# EAGLE design amplifier (EAGLE 9.2.2)
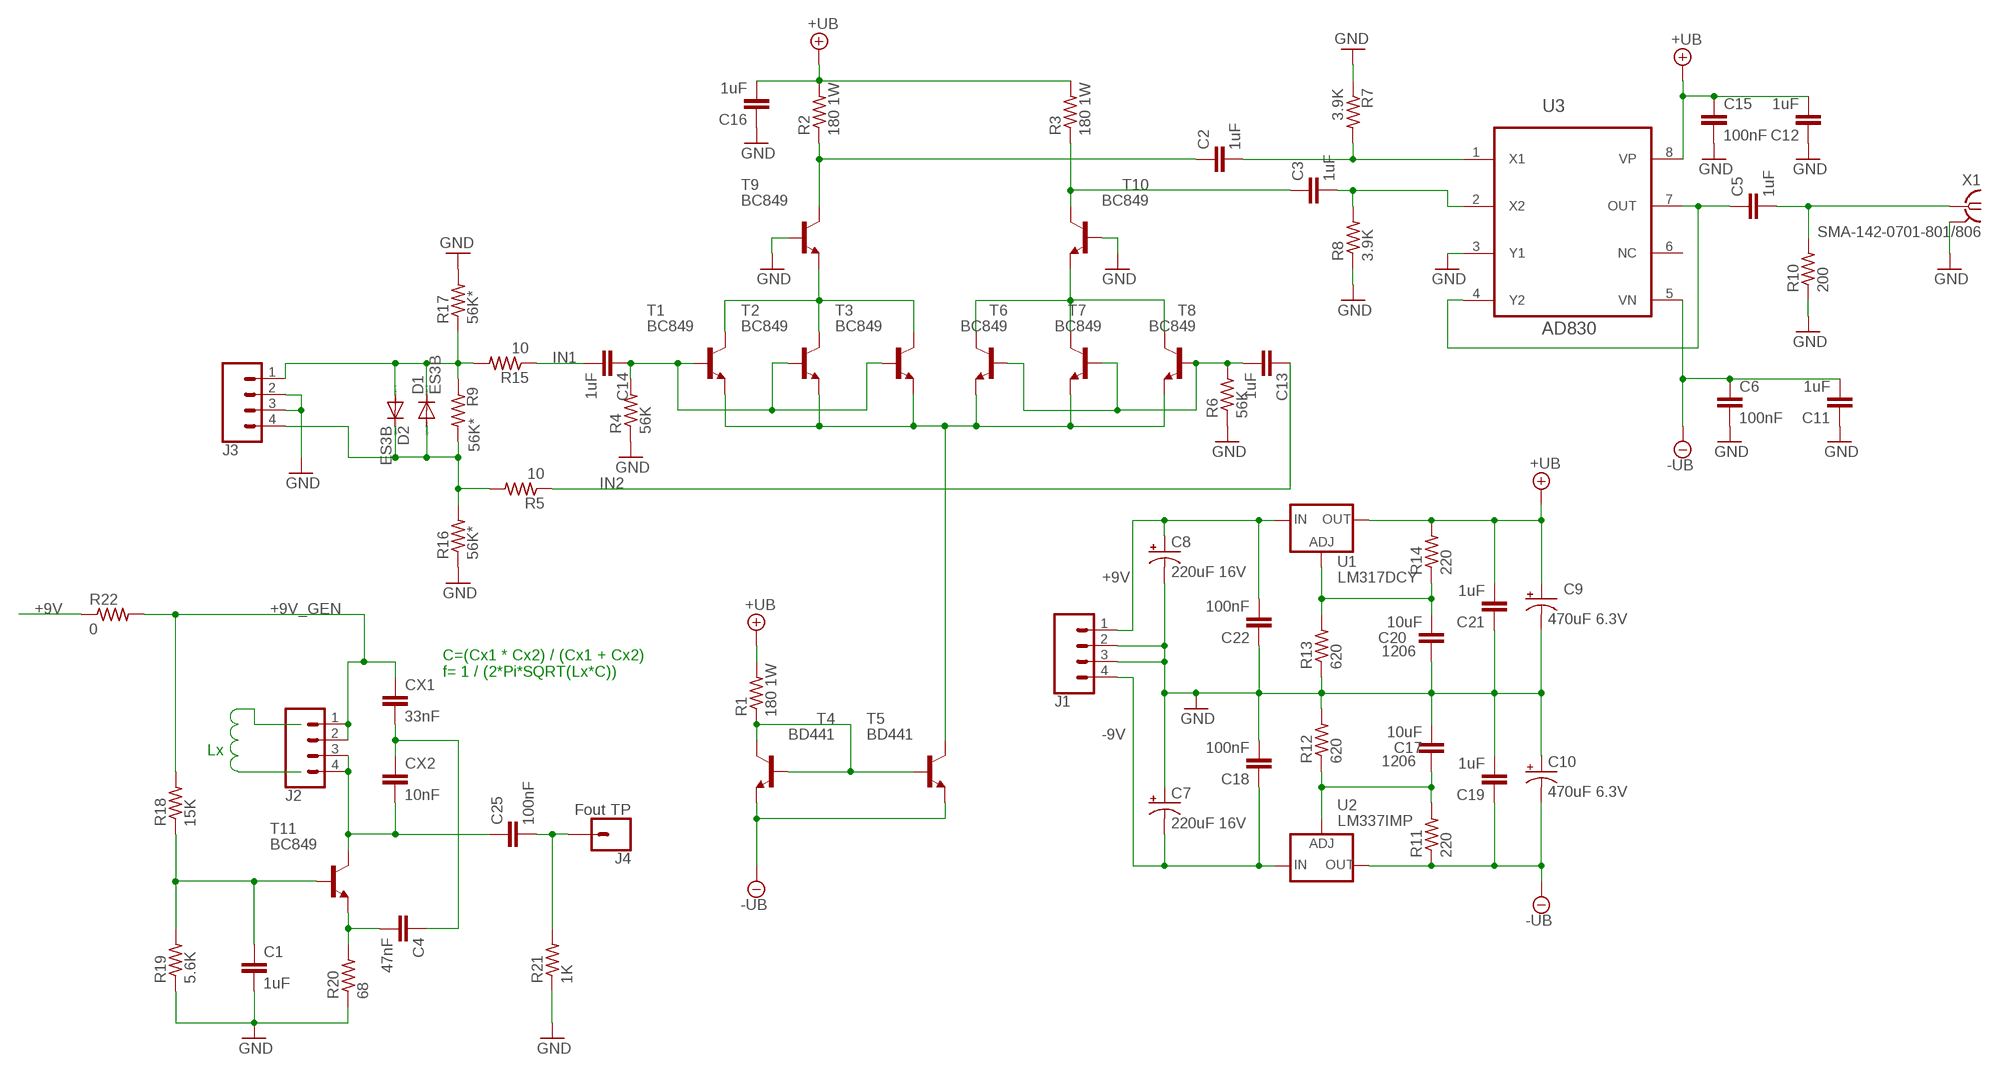
[diagram p0: schematic, sheet 1]

## Parts
C1  1uF  C-EUC0805  [C0805]
C2  1uF  C-EUC0805  [C0805]
C3  1uF  C-EUC0805  [C0805]
C4  47nF  C-EUC0805  [C0805]
C5  1uF  C-EUC0805  [C0805]
C6  100nF  C-EUC0805  [C0805]
C7  220uF 16V  CPOL-US153CLV-1010  [153CLV-1010]
C8  220uF 16V  CPOL-US153CLV-1010  [153CLV-1010]
C9  470uF 6.3V  CPOL-US153CLV-1010  [153CLV-1010]
C10  470uF 6.3V  CPOL-US153CLV-1010  [153CLV-1010]
C11  1uF  C-EUC0805  [C0805]
C12  1uF  C-EUC0805  [C0805]
C13  1uF  C-EUC0805  [C0805]
C14  1uF  C-EUC0805  [C0805]
C15  100nF  C-EUC0805  [C0805]
C16  1uF  C-EUC0805  [C0805]
C17  10uF  C-EUC1206  [C1206]
C18  100nF  C-EUC0805  [C0805]
C19  1uF  C-EUC0805  [C0805]
C20  10uF  C-EUC1206  [C1206]
C21  1uF  C-EUC0805  [C0805]
C22  100nF  C-EUC0805  [C0805]
C25  100nF  C-EUC0805  [C0805]
CX1  33nF  C-EUC0805  [C0805]
CX2  10nF  C-EUC0805  [C0805]
D1  ES3B  DIODE-SMC  [SMC]
D2  ES3B  DIODE-SMC  [SMC]
J1  CONN_04LONGPADS  [1X04_LONGPADS]
J2  CONN_04LONGPADS  [1X04_LONGPADS]
J3  CONN_04LONGPADS  [1X04_LONGPADS]
J4  Fout TP  CONN_01SNAP-MALE  [SNAP-MALE]
R1  180 1W  R-US_R1206W  [R1206W]
R2  180 1W  R-US_R1206W  [R1206W]
R3  180 1W  R-US_R1206W  [R1206W]
R4  56K  R-US_R1206W  [R1206W]
R5  10  R-US_R1206W  [R1206W]
R6  56K  R-US_R1206W  [R1206W]
R7  3.9K  R-US_R1206W  [R1206W]
R8  3.9K  R-US_R1206W  [R1206W]
R9  56K*  R-US_R1206W  [R1206W]
R10  200  R-US_R1206W  [R1206W]
R11  220  R-US_R1206W  [R1206W]
R12  620  R-US_R1206W  [R1206W]
R13  620  R-US_R1206W  [R1206W]
R14  220  R-US_R1206W  [R1206W]
R15  10  R-US_R1206W  [R1206W]
R16  56K*  R-US_R1206W  [R1206W]
R17  56K*  R-US_R1206W  [R1206W]
R18  15K  R-US_R1206W  [R1206W]
R19  5.6K  R-US_R1206W  [R1206W]
R20  68  R-US_R1206W  [R1206W]
R21  1K  R-US_R1206W  [R1206W]
R22  0  R-US_R1206W  [R1206W]
T1  BC849  [SOT23]
T2  BC849  [SOT23]
T3  BC849  [SOT23]
T4  BD441  -NPN-TO126  [TO126]
T5  BD441  -NPN-TO126  [TO126]
T6  BC849  [SOT23]
T7  BC849  [SOT23]
T8  BC849  [SOT23]
T9  BC849  [SOT23]
T10  BC849  [SOT23]
T11  BC849  [SOT23]
U1  LM317DCY  [SOT223]
U2  LM337IMP  [SOT223]
U3  AD830  [SOIC127P600X175-8N]
X1  SMA-142-0701-801/806  [J502-ND-142-0701-801/806]

## Nets
+9V [power]: C8.+ C22.2 J1.1 R22.1 U1.3(IN)
+9V_GEN [power]: CX1.1 J2.1 J2.2 R18.2 R22.2
+UB [power]: C9.+ C12.2 C15.1 C16.2 C21.2 R1.2 R2.2 R3.2 R14.2 U1.2(OUT) U1.4(OUT) U3.8(VP)
-9V [power]: C7.- C18.1 J1.4 U2.2(IN) U2.4(IN)
-UB [power]: C6.1 C10.- C11.2 C19.1 R11.1 T4.1(E) T5.1(E) U2.3(OUT) U3.5(VN)
GND [power]: C1.2 C6.2 C7.+ C8.- C9.- C10.+ C11.1 C12.1 C15.2 C16.1 C17.2 C18.2 C19.2 C20.1 C21.1 C22.1 J1.2 J1.3 J3.2 J3.3 R4.1 R6.1 R7.1 R8.1 R10.1 R12.2 R13.1 R16.1 R17.2 R19.1 R20.1 R21.1 T9.1(B) T10.1(B) U3.3(Y1) X1.G@1 X1.G@2 X1.G@3 X1.G@4
IN1: C14.2 R15.1
IN2: C13.1 R5.1
N$1: D1.C D2.A J3.1 R9.1 R15.2 R17.1
N$2: C17.1 R11.2 R12.1 U2.1(ADJ)
N$3: D1.A D2.C J3.4 R5.2 R9.2 R16.2
N$5: R1.1 T4.2(C) T4.3(B) T5.3(B)
N$6: C25.1 CX2.2 J2.3 J2.4 T11.3(C)
N$7: C2.2 R7.2 U3.1(X1)
N$8: C25.2 J4.2 R21.2
N$9: C20.2 R13.2 R14.1 U1.1(ADJ)
N$10: C4.1 CX1.2 CX2.1
N$11: C4.2 R20.2 T11.2(E)
N$12: T1.2(E) T2.2(E) T3.2(E) T5.2(C) T6.2(E) T7.2(E) T8.2(E)
N$13: C1.1 R18.1 R19.2 T11.1(B)
N$14: C13.2 R6.2 T6.1(B) T7.1(B) T8.1(B)
N$15: C14.1 R4.2 T1.1(B) T2.1(B) T3.1(B)
N$16: T1.3(C) T2.3(C) T3.3(C) T9.2(E)
N$19: T6.3(C) T7.3(C) T8.3(C) T10.2(E)
N$23: C2.1 R2.1 T9.3(C)
N$24: C3.1 R3.1 T10.3(C)
N$25: C3.2 R8.2 U3.2(X2)
N$26: C5.1 U3.4(Y2) U3.7(OUT)
N$27: C5.2 R10.2 X1.1

## Notes on the sheet
- C=(Cx1 * Cx2) / (Cx1 + Cx2)
  f= 1 / (2*Pi*SQRT(Lx*C))
- Lx

## Power pins joined to a net without a drawn wire
NC: U3.6(NC)

## Library data of the parts
C1-C6 C11-C16 C18 C19 C21 C22 C25 CX1 CX2 = resistor:C-EU: CAPACITOR, European symbol
C7-C10 = rcl:CPOL-US: POLARIZED CAPACITOR, American symbol; SPICEPREFIX: C
C17 C20 = resistor:C-EU: CAPACITOR, European symbol; PACKAGE: 1206
D1 D2 = diode:DIODE-: DIODE
J1-J3 = SparkFun-Connectors:CONN_04: Multi connection point. Often used as Generic Header-pin footprint for 0.1 inch spaced/style header connections On any of the 0.1 inch spaced packages, you can populate with these: Break Away Headers - Straight <https://www.sparkfun.com/products/116> (PRT-00116) Break Away Male Headers - Right Angle <https://www.sparkfun.com/products/553> (PRT-00553) Female Headers <https://www.sparkfun.com/products/115> (PRT-00115) Break Away Headers - Machine Pin <https://www.sparkfun.com/products/117> (PRT-00117) Break Away Female Headers - Swiss Machine Pin <https://www.sparkfun.com/products/743> (PRT-00743) For SCREWTERMINALS and SPRING TERMINALS visit here: Screw Terimnals on SparkFun.com <https://www.sparkfun.com/search/results?term=Screw+Terminals> (5mm/3.5mm/2.54mm spacing) This device is also useful as a general connection point to wire up your design to another part of your project. Our various solder wires solder well into these plated through hole pads. Hook-Up Wire - Assortment (Stranded, 22 AWG) <https://www.sparkfun.com/products/11375> (PRT-11375) Hook-Up Wire - Assortment (Solid Core, 22 AWG) <https://www.sparkfun.com/products/11367> (PRT-11367) View the entire wire category on our website here <https://www.sparkfun.com/categories/141> Special notes: Molex polarized connector foot print use with SKU : PRT-08231 with associated crimp pins and housings. 1MM SMD Version SKU: PRT-10208; PROD_ID: CONN-09696
J4 = SparkFun-Connectors:CONN_01: Single connection point. Often used as Generic Header-pin footprint for 0.1 inch spaced/style header connections On any of the 0.1 inch spaced packages, you can populate with these: Break Away Headers - Straight <https://www.sparkfun.com/products/116> (PRT-00116) Break Away Male Headers - Right Angle <https://www.sparkfun.com/products/553> (PRT-00553) Female Headers <https://www.sparkfun.com/products/115> (PRT-00115) Break Away Headers - Machine Pin <https://www.sparkfun.com/products/117> (PRT-00117) Break Away Female Headers - Swiss Machine Pin <https://www.sparkfun.com/products/743> (PRT-00743) This device is also useful as a general connection point to wire up your design to another part of your project. Our various solder wires solder well into these plated through hole pads. Hook-Up Wire - Assortment (Stranded, 22 AWG) <https://www.sparkfun.com/products/11375> (PRT-11375) Hook-Up Wire - Assortment (Solid Core, 22 AWG) <https://www.sparkfun.com/products/11367> (PRT-11367) View the entire wire category on our website here <https://www.sparkfun.com/categories/141> Special notes: SMTSO-256-ET is a "flush mount" nut for a 4-40 screw. We mostly use this on specialty testbeds; it is a nice way to connect hardware to your PCB at an adjustable hieght. Also note, the SNAP packages are for using a snappable style connector. We sell a baggie of snaps and they are also used on two LilyPad designs: Snap Assortment - 30 pack (male and female) <https://www.sparkfun.com/products/11347> (DEV-11347) LilyPad Arduino SimpleSnap <https://www.sparkfun.com/products/10941> (DEV-10941) LilyPad SimpleSnap Protoboard <https://www.sparkfun.com/products/10940> (DEV-10940)
R1-R22 = resistor:R-US_: RESISTOR, American symbol
T1-T3 T6-T11 = transistor:BC849: NPN TRANSISTOR
T4 T5 = transistor:*-NPN-: NPN Transistror BF959 corrected 2008.03.06
U1 = modified-v-reg:LM317DCY
U2 = modified-v-reg:LM337IMP: Adjustable 3-terminal negative-voltage regulator capable of supplying in excess of –1.5 A over an output voltage range of –1.2 to –37 V.
U3 = AD830:AD830
X1 = con-coax:SMA-: SMA 50 Ohm End Launch Jack Receptacle - Round Contact Johnson Components Source: www.johnsoncomponents.com .. J502-ND.pdf; MF: JOHNSON COMPONENTS; MPN: 142-0701-801; OC_FARNELL: 1608592; OC_NEWARK: 90F2624

## Net classes
0 default: width 0.3 mm, drill 0.3 mm, clearance 0.508 mm
1 power: width 0.61 mm, drill 0.5 mm, clearance 0.508 mm to class 0, clearance 0.508 mm

## Board
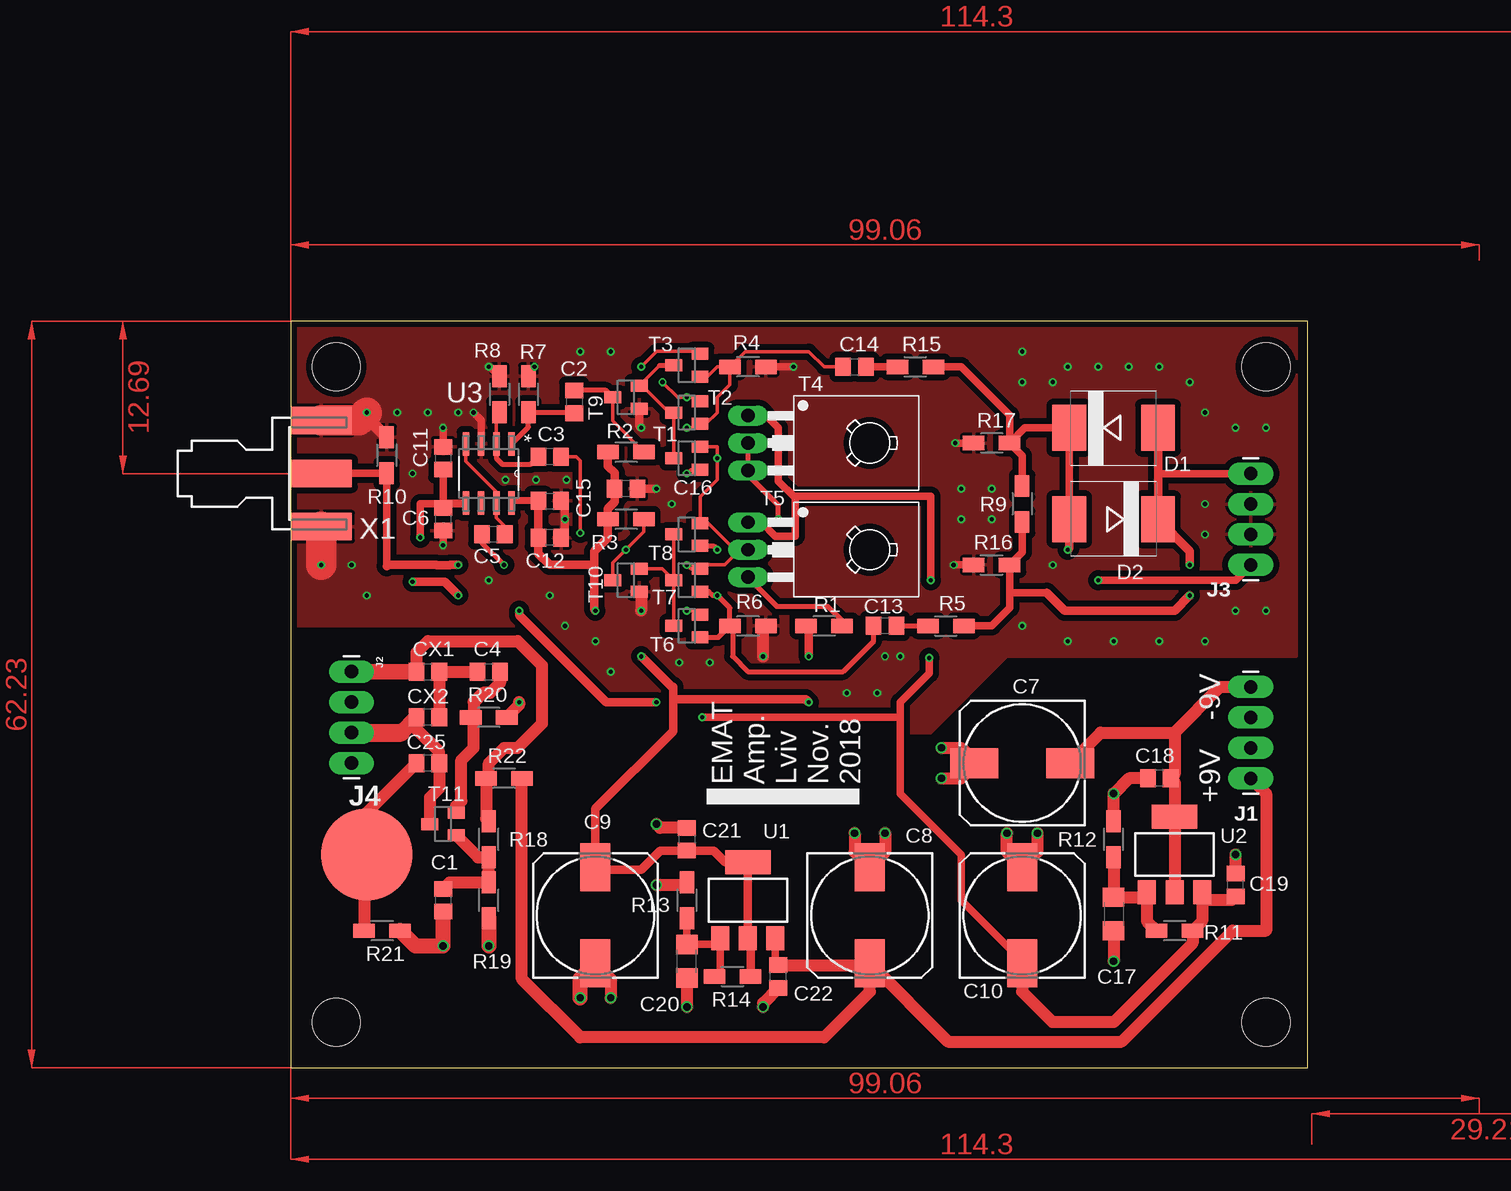
[diagram p1: board, top side]
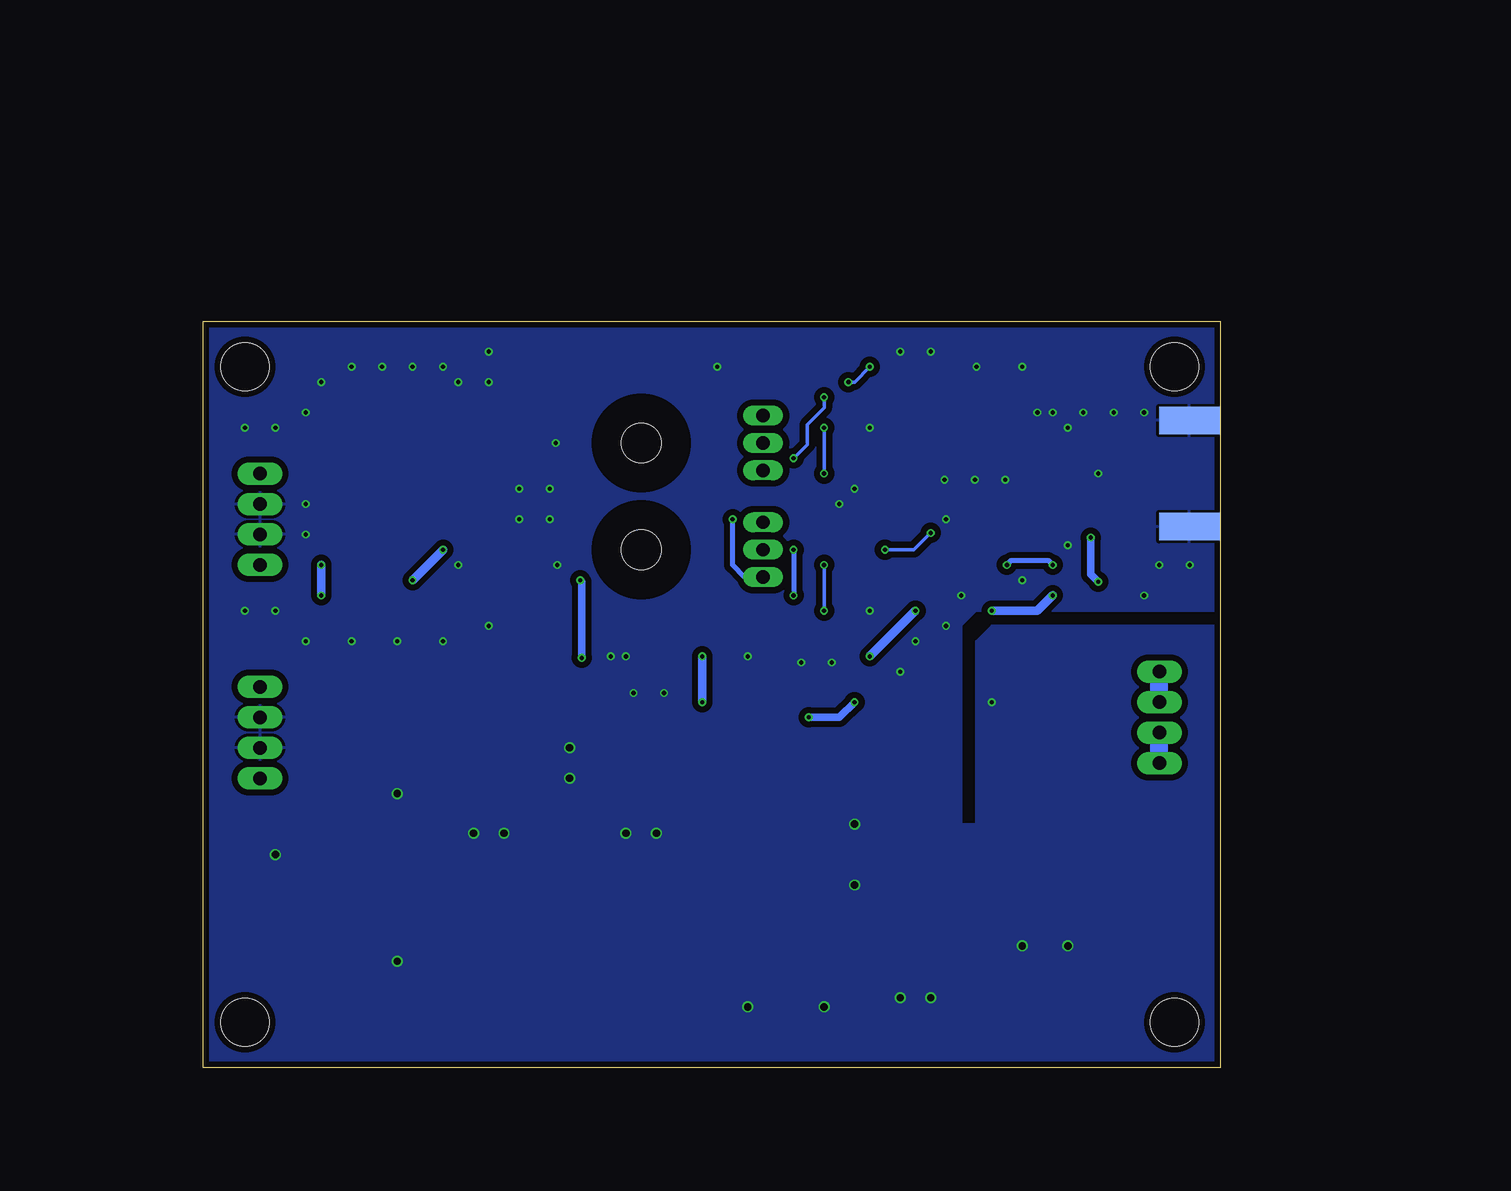
[diagram p2: board, bottom side, seen from below]

Size 84.76 x 62.22 mm. Coordinates in mm from the lower left corner, seen from the top.
Outline: 0,0 84.76,0 84.76,62.22 0,62.22 0,0
Copper layers (1*16): Top 0.035mm / dielectric 1.6mm / Bottom 0.035mm
Design rules "Elecrow_2-layer_PCB_eagle_rule *": minimum track width 6mil, minimum drill 0.3mm, track to track 6mil, track to pad 6mil, pad to pad 6mil, via to via 8mil, smd to smd 0mil, copper to edge 20mil, drill to drill 10mil, minimum pad ring 6mil, minimum via ring 6mil, stop-mask expansion 0mil, vias tented up to drill 100mil, thermal gap 10mil
Holes 4 mm at 3.81,3.81 3.81,58.42 81.28,58.42 81.28,3.81

### Footprints (pad centres in the part's own frame; a part is rotated, then mirrored left to right if it is on the bottom)
C0805 = smd 1.3 x 1.5: 1 -0.95,0; 2 0.95,0
153CLV-1010 = smd 4 x 2.5: + 4,0; - -4,0
C1206 = smd 1.6 x 1.8: 1 -1.4,0; 2 1.4,0
SMC = smd 2.8 x 3.8: A 3.7,0; C -3.7,0
1X04_LONGPADS = drill 1.118 pad 1.88 long: 1 0,0; 2 2.54,0; 3 5.08,0; 4 7.62,0
SNAP-MALE = smd 7.62 x 7.62: 2 0,0
R1206W = smd 1.8 x 1.2: 1 -1.499,0; 2 1.499,0
SOT23 = smd 1 x 1.4: 1 -0.95,-1.1; 2 0.95,-1.1; 3 0,1.1
TO126 = drill 1.118 long: 1 -2.286,-5.08; 2 0,-5.08; 3 2.286,-5.08 | hole 3.302: 0,5.08
SOT223 = smd 1.5 x 2: 1 -2.3,-3.15; 2 0,-3.15; 3 2.3,-3.15 | smd 3.8 x 2: 4 0,3.15
SOIC127P600X175-8N = smd 1.981 x 0.559: 1 -2.464,1.905; 2 -2.464,0.635; 3 -2.464,-0.635; 4 -2.464,-1.905; 5 2.464,-1.905; 6 2.464,-0.635; 7 2.464,0.635; 8 2.464,1.905
J502-ND-142-0701-801/806 = smd 5.08 x 2.286: 1 2.565,0; G@1 2.565,4.42; G@2 2.565,-4.42 | smd 5.08 x 2.286 bottom: G@3 2.565,4.42; G@4 2.565,-4.42

### Placement (x,y rotation side)
C1  12.7,13.97 270 top
C2  23.62,55.5 270 top
C3  21.59,50.93 180 top
C4  16.51,33.02 0 top
C5  16.89,44.45 180 top
C6  12.7,45.72 270 top
C7  60.96,25.4 180 top
C8  48.26,12.7 270 top
C9  25.4,12.7 90 top
C10  60.96,12.7 90 top
C11  12.7,50.8 270 top
C12  21.59,44.2 180 top
C13  49.53,36.83 180 top
C14  46.99,58.42 0 top
C15  21.59,47.24 0 top
C16  27.94,48.26 180 top
C17  68.58,12.83 270 top
C18  72.39,24.13 180 top
C19  78.74,15.24 90 top
C20  33.02,8.89 90 top
C21  33.02,19.05 270 top
C22  40.64,7.62 90 top
C25  11.43,25.4 180 top
CX1  11.43,33.02 0 top
CX2  11.43,29.21 180 top
D1  68.58,53.34 0 top
D2  68.58,45.72 180 top
J1  80.01,24.13 90 top
J2  5.08,33.02 270 top
J3  80.01,41.91 90 top
J4  6.35,17.78 0 top
R1  44.45,36.83 180 top
R2  27.94,51.31 180 top
R3  27.94,45.72 180 top
R4  38.1,58.42 180 top
R5  54.61,36.83 0 top
R6  38.1,36.83 180 top
R7  19.81,56.13 270 top
R8  17.4,56.13 270 top
R9  60.96,46.99 270 top
R10  8,51.05 270 top
R11  73.66,11.43 180 top
R12  68.58,19.05 90 top
R13  33.02,13.97 270 top
R14  36.83,7.62 0 top
R15  52.07,58.42 0 top
R16  58.42,41.91 0 top
R17  58.42,52.07 180 top
R18  16.51,19.05 90 top
R19  16.51,13.97 90 top
R20  16.51,29.21 180 top
R21  7.62,11.43 180 top
R22  17.78,24.13 180 top
T1  33.02,50.8 90 top
T2  33.02,54.61 90 top
T3  33.02,58.55 90 top
T4  43.18,52.07 270 top
T5  43.18,43.18 270 top
T6  33.02,36.83 90 top
T7  33.02,40.64 90 top
T8  33.02,44.45 90 top
T9  27.94,55.88 90 top
T10  27.94,40.64 90 top
T11  12.7,20.32 90 top
U1  38.1,13.97 0 top
U2  73.66,17.78 0 top
U3  16.51,49.53 270 top
X1  0,49.53 0 top

### Tracks (layer width: path | path; a pad name or v marks a point on that pad's centre or on a via)
+9V
  Top 0.61: U1.3 40.4,8.81 C22.2
  Top 1.016: C22.2 48.13,8.57 C8.+ | C8.+ 54.78,2.18 69.25,2.18 78.5,11.43 81.28,11.43 81.28,22.86 J1.1 | C8.+ 48.26,6.35 44.45,2.54 24.13,2.54 19.28,7.39 R22.1
+9V_GEN
  Top 1: R18.2 16.28,20.78 R22.2 16.51,24.36 16.51,25.4 17.78,26.67 18.92,26.67 20.95,28.7 20.95,33.53 18.92,35.56 11.43,35.56 10.48,34.61 CX1.1
  Top 1.3: J2.1 CX1.1
  Bottom 1.5: J2.2 J2.1
+UB  (via drill 0.35)
  Top 0.6: C15.1 18.59,47.24 U3.8
  Top 0.7: R14.2 38.33,10.59 U1.2 U1.4 36.22,17.12 35.24,18.1 C21.2 30.8,18.1 29.21,16.51 25.59,16.51 C9.+ 25.4,21.59 31.88,28.07 31.88,30.73 | R2.2 26.44,50.14 26.99,49.59 C16.2 26.99,47.16 26.44,46.61 R3.2 26.42,45.7 26.42,44.2 25.28,43.06 25.28,41.91 | v43.18,30.48 42.93,30.73 31.88,30.73 | v43.18,34.29 43.18,36.6 R1.2 | 31.88,30.73 31.88,31.75 31.75,31.75 v29.21,34.29 | 25.28,41.91 25.28,38.22 v25.4,38.1 | C15.1 C12.2 20.64,42.86 21.59,41.91 25.28,41.91
  Bottom 0.7: v43.18,34.29 v43.18,30.48 | v25.4,38.1 v29.21,34.29
-9V
  Top 1.016: U2.2 U2.4 73.66,23.81 C18.1 73.66,24.45 73.66,27.94 | C7.- 67.5,27.94 73.66,27.94 | 73.66,27.94 77.47,31.75 J1.4
-UB  (via drill 0.35)
  Top 0.61: v53.34,40.64 53.34,47.62 41.91,47.62 | T4.1 39.62,54.36 40.64,53.34 40.64,48.9 41.91,47.62 | v53.21,34.16 53.21,32.89 50.8,30.48 50.8,29.21 | 50.8,29.21 50.8,22.86 55.88,17.78 55.88,13.97 60.96,8.89 C10.- | C11.2 C6.1 13.1,47.07 U3.5 14.53,46.99 10.79,46.99 v10.79,44.2 | v34.29,29.21 50.8,29.21 | T5.1 39.24,45.47 40.39,44.32 42.04,44.32 42.04,47.5 41.91,47.62
  Top 0.7: v10.16,40.51 12.83,40.51 v13.97,39.37 | v30.48,30.48 26.29,30.48 19.05,37.72 v19.05,38.1
  Top 1.016: C19.1 78.42,13.97 76.2,13.97 75.96,14.21 U2.3 75.96,12.23 R11.1 75.16,10.39 68.58,3.81 63.5,3.81 60.96,6.35 C10.-
  Bottom 0.61: v53.34,40.64 53.21,40.51 v53.21,34.16 | v30.48,30.48 31.75,29.21 v34.29,29.21 | v10.79,44.2 10.79,41.15 v10.16,40.51
  Bottom 0.7: v13.97,39.37 15.24,38.1 v19.05,38.1
GND  (via drill 0.35, 0.61)
  Top 0.61: U3.3 15.88,53.98 v15.24,54.61 | R4.1 v41.91,58.42 | C11.1 v12.7,53.34 | C6.2 v12.7,43.56 | R8.1 16.61,58.42 v16.51,58.42 | R7.1 19.81,57.91 v20.32,58.42 | R17.2 v55.37,52.07 | R16.1 v55.24,41.91
  Top 0.7: C15.2 22.86,46.92 v22.86,45.72 22.86,44.52 C12.1 | C16.1 v30.48,48.26 | T9.1 29.04,53.51 v29.21,53.34
  Top 1: v62.23,19.56 62.23,17.97 C10.+
  Top 1.016: C9.- 26.67,7.43 v26.67,5.84 | C20.1 v33.02,5.08 | C22.1 39.37,5.4 v39.37,5.08 | v49.53,19.56 49.53,17.97 C8.- 46.99,17.97 v46.99,19.56 | R13.1 32.79,15.24 v30.48,15.24 | C21.1 30.8,20 v30.48,20.32 | v54.23,26.67 55.88,26.67 57.15,25.4 | 57.15,25.4 C7.+ | v54.23,24.13 55.88,24.13 57.15,25.4 | C10.+ 59.69,17.97 v59.69,19.56 | R12.2 v68.58,22.86 69.85,24.13 C18.2 | C17.2 v68.58,8.89 | v19.05,30.48 19.05,30.25 R20.1 | C19.2 v78.74,17.78 | v39.37,34.29 39.34,34.31 39.34,36.58 R6.1 | T10.1 29.21,39.52 v29.21,38.1 | R10.1 6.6,53.95 5.69,53.95
  Top 1.27: R21.1 10.39,10.16 v12.7,10.16 C1.2 | R19.1 v16.51,10.16 | v24.13,5.84 24.13,7.43 C9.-
  Top 2.54: X1.G@4 2.56,41.94 v2.54,41.91 | X1.G@3 5.69,53.95 v6.35,54.61
  other vias: 60.96,59.69 17.91,49.02 20.45,49.02 49.53,34.29 50.8,34.29 34.92,33.78 5.08,41.91 6.35,39.37 16.51,40.64 21.59,39.37 22.86,36.83 25.4,35.56 26.67,33.02 8.89,54.61 11.43,54.61 13.97,54.61 24.13,59.69 26.67,59.69 46.35,31.24 48.9,31.24 78.74,38.1 81.28,38.1 81.28,53.34 78.74,53.34 64.77,58.42 67.31,58.42 63.5,57.15 63.5,41.91 31.75,46.99 10.16,49.53 60.96,57.15 58.42,45.72 55.88,48.26 60.96,36.83 64.77,35.56 68.58,35.56 72.39,35.56 76.2,35.56 76.2,54.61 74.93,57.15 72.39,58.42 69.85,58.42 76.2,46.99 76.2,44.45 55.88,45.72 58.42,48.26 32.38,33.78 22.99,49.02
  pour Bottom (isolate 0.305): 0,62.23 99.06,62.23 99.06,0 0,0 0,36.83 19.05,36.83 20.32,35.56 20.32,20.32 21.59,20.32 21.59,36.83 20.32,38.1 0,38.1
  pour Top (isolate 0.305): 0,62.23 83.82,62.23 83.82,34.29 59.69,34.29 53.34,27.94 27.94,27.94 19.05,36.83 0,36.83
IN1
  Top 0.61: R15.1 C14.2
IN2
  Top 0.406: C13.1 R5.1
N$1  (via drill 0.35)
  Top 0.61: D2.A D1.C 61.19,53.34 R17.1 | R17.1 60.96,51.03 R9.1 | v67.31,40.64 78.74,40.64 J3.1 | R15.2 55.88,58.42 59.92,54.38 R17.1
  Top 0.7: D2.A 64.88,43.29 v64.77,43.18
  Bottom 0.7: v67.31,40.64 v64.77,43.18
N$2
  Top 1.016: R11.2 71.36,12.23 U2.1 70.96,14.23 C17.1 R12.1
N$3  (via drill 0.35)
  Top 0.61: R5.2 58.42,36.83 59.92,38.33 59.92,39.37 | 59.92,39.37 R16.2 60.96,42.95 R9.2 | 63.02,39.6 60.15,39.6 59.92,39.37 | J3.4 72.28,49.53
  Top 0.7: v74.93,41.91 74.93,43.07 D2.C 72.28,49.53 D1.A | 63.02,39.6 64.52,38.1 73.66,38.1 v74.93,39.37
  Bottom 0.7: v74.93,41.91 v74.93,39.37
N$5  (via drill 0.35)
  Top 0.4: T5.3 40.55,38.45 44.78,38.45 45.95,37.28 R1.1 | T4.2 T4.3 38.1,49.44 40.64,46.9 v40.64,45.72
  Bottom 0.4: T5.3 39.62,40.89 40.64,41.91 v40.64,45.72
N$6
  Top 1: C25.1 12.38,23.3 11.6,22.52
  Top 1.016: 11.6,22.52 T11.3 | C25.1 12.38,26.34 10.48,28.24 CX2.2
  Top 1.3: 9.21,27.94 CX2.2
  Top 1.5: J2.3 9.21,27.94
  Bottom 1.5: J2.4 J2.3
N$7
  Top 0.4: U3.1 19.81,53.39 R7.2 23.54,54.63 C2.2
N$8
  Top 1.016: C25.2 6.35,21.27 J4.2 6.12,17.55 R21.2
N$9
  Top 0.61: R14.1 35.8,8.09 U1.1 35.27,10.29 C20.2 R13.2
N$10
  Top 1.016: CX2.1 CX1.2 C4.1
N$11
  Top 1.016: C4.2 17.46,32.08 16.63,31.25 16.01,31.25 15.24,30.48 15.24,29.44 R20.2 15.24,28.98 15.24,26.67 14.22,25.65 14.22,22.23 13.8,21.8 T11.2
N$12  (via drill 0.35)
  Top 0.3: 34.14,45.42 34.14,47.6 35.56,49.02 v35.56,50.8 35.56,51.75 | T2.2 33.8,55.88 v33.02,55.88 32.26,55.88 v30.99,57.15 | T3.2 33.86,59.5 33.66,59.7 30.5,59.7 v29.21,58.42
  Top 0.305: T6.2 33.8,38.1 v33.02,38.1 | v33.02,41.91 33.34,41.59 T7.2 34.44,41.91 36.16,41.91 36.83,42.58 36.83,43.18 T5.2 36.99,43.18 34.75,45.42 34.14,45.42 T8.2 | 35.56,51.75 T1.2
  Bottom 0.3: v33.02,38.1 v33.02,41.91 | v33.02,55.88 33.02,54.99 34.42,53.59 34.42,51.94 v35.56,50.8 | v29.21,58.42 30.48,57.15 v30.99,57.15
N$13
  Top 1.016: C1.1 13.25,15.47 R19.2 R18.1 15.62,17.55 T11.1
N$14  (via drill 0.35)
  Top 0.4: T6.1 35.65,35.88 R6.2 | R6.2 36.83,36.6 36.83,34.29 38.1,33.02 46.04,33.02 48.58,35.56 C13.2 | T7.1 34.85,39.69 35.17,39.37 v35.56,39.37 36.6,38.33 R6.2 | T8.1 35.24,43.5 v35.56,43.18
  Bottom 0.4: v35.56,43.18 v35.56,39.37
N$15  (via drill 0.35)
  Top 0.3: v33.02,53.34 33.8,53.34 T2.1 34.61,53.66 35.56,54.61 35.56,55.88 36.6,56.92 R4.2 35.56,58.42 34.74,57.6 T3.1 | T1.1 33.34,49.85 v33.02,49.53
  Top 0.305: R4.2 37.87,59.69 43.18,59.69 44.45,58.42 C14.1
  Bottom 0.3: v33.02,53.34 v33.02,49.53
N$16
  Top 0.3: T1.3 T2.3 31.54,54.61 29.32,56.83 T9.2 29.62,57.41 29.63,57.41 30.22,58 30.22,58.01 30.76,58.55
  Top 0.4: 30.76,58.55 T3.3
N$19
  Top 0.305: T7.3 T6.3 | T8.3 T7.3 | T10.2 30.97,41.59 T7.3
N$23
  Top 0.3: R2.1 26.84,53.91 T9.3
  Top 0.4: T9.3 26.27,56.45 C2.1
N$24  (via drill 0.35)
  Top 0.305: T10.3 26.84,42.08 v27.94,43.18 29.44,44.68 R3.1 | C3.1 23.81,50.93 24.13,50.61 v24.13,44.58
  Bottom 0.305: v24.13,44.58 25.53,43.18 v27.94,43.18
N$25
  Top 0.305: U3.2 17.14,54.38 R8.2
  Top 0.4: U3.2 17.14,50.8 17.65,50.29 20,50.29 C3.2
N$26
  Top 0.3: U3.7 17.14,45.85 17.84,45.15 C5.1 | U3.4 14.61,50.8
  Top 0.305: U3.7 17.14,48 14.61,50.54 14.61,50.8
N$27  (via drill 0.35)
  Top 0.4: C5.2 15.94,43.75 v17.78,41.91
  Top 0.61: X1.1 2.59,49.55 R10.2 8,41.78
  Top 0.7: 8,41.78 8.13,41.91 12.12,41.91 12.16,41.87 13.24,41.87 13.28,41.91 v13.97,41.91
  Bottom 0.4: v17.78,41.91 17.4,42.29 14.35,42.29 v13.97,41.91
(copper drawn outside any net)
  shapes: Top area x8

### Text on the board
tNames: -9V | EMAT / Amp. / Lviv / Nov. / 2018 | +9V